# Altium schematic sheet GBA.SchDoc
size A2
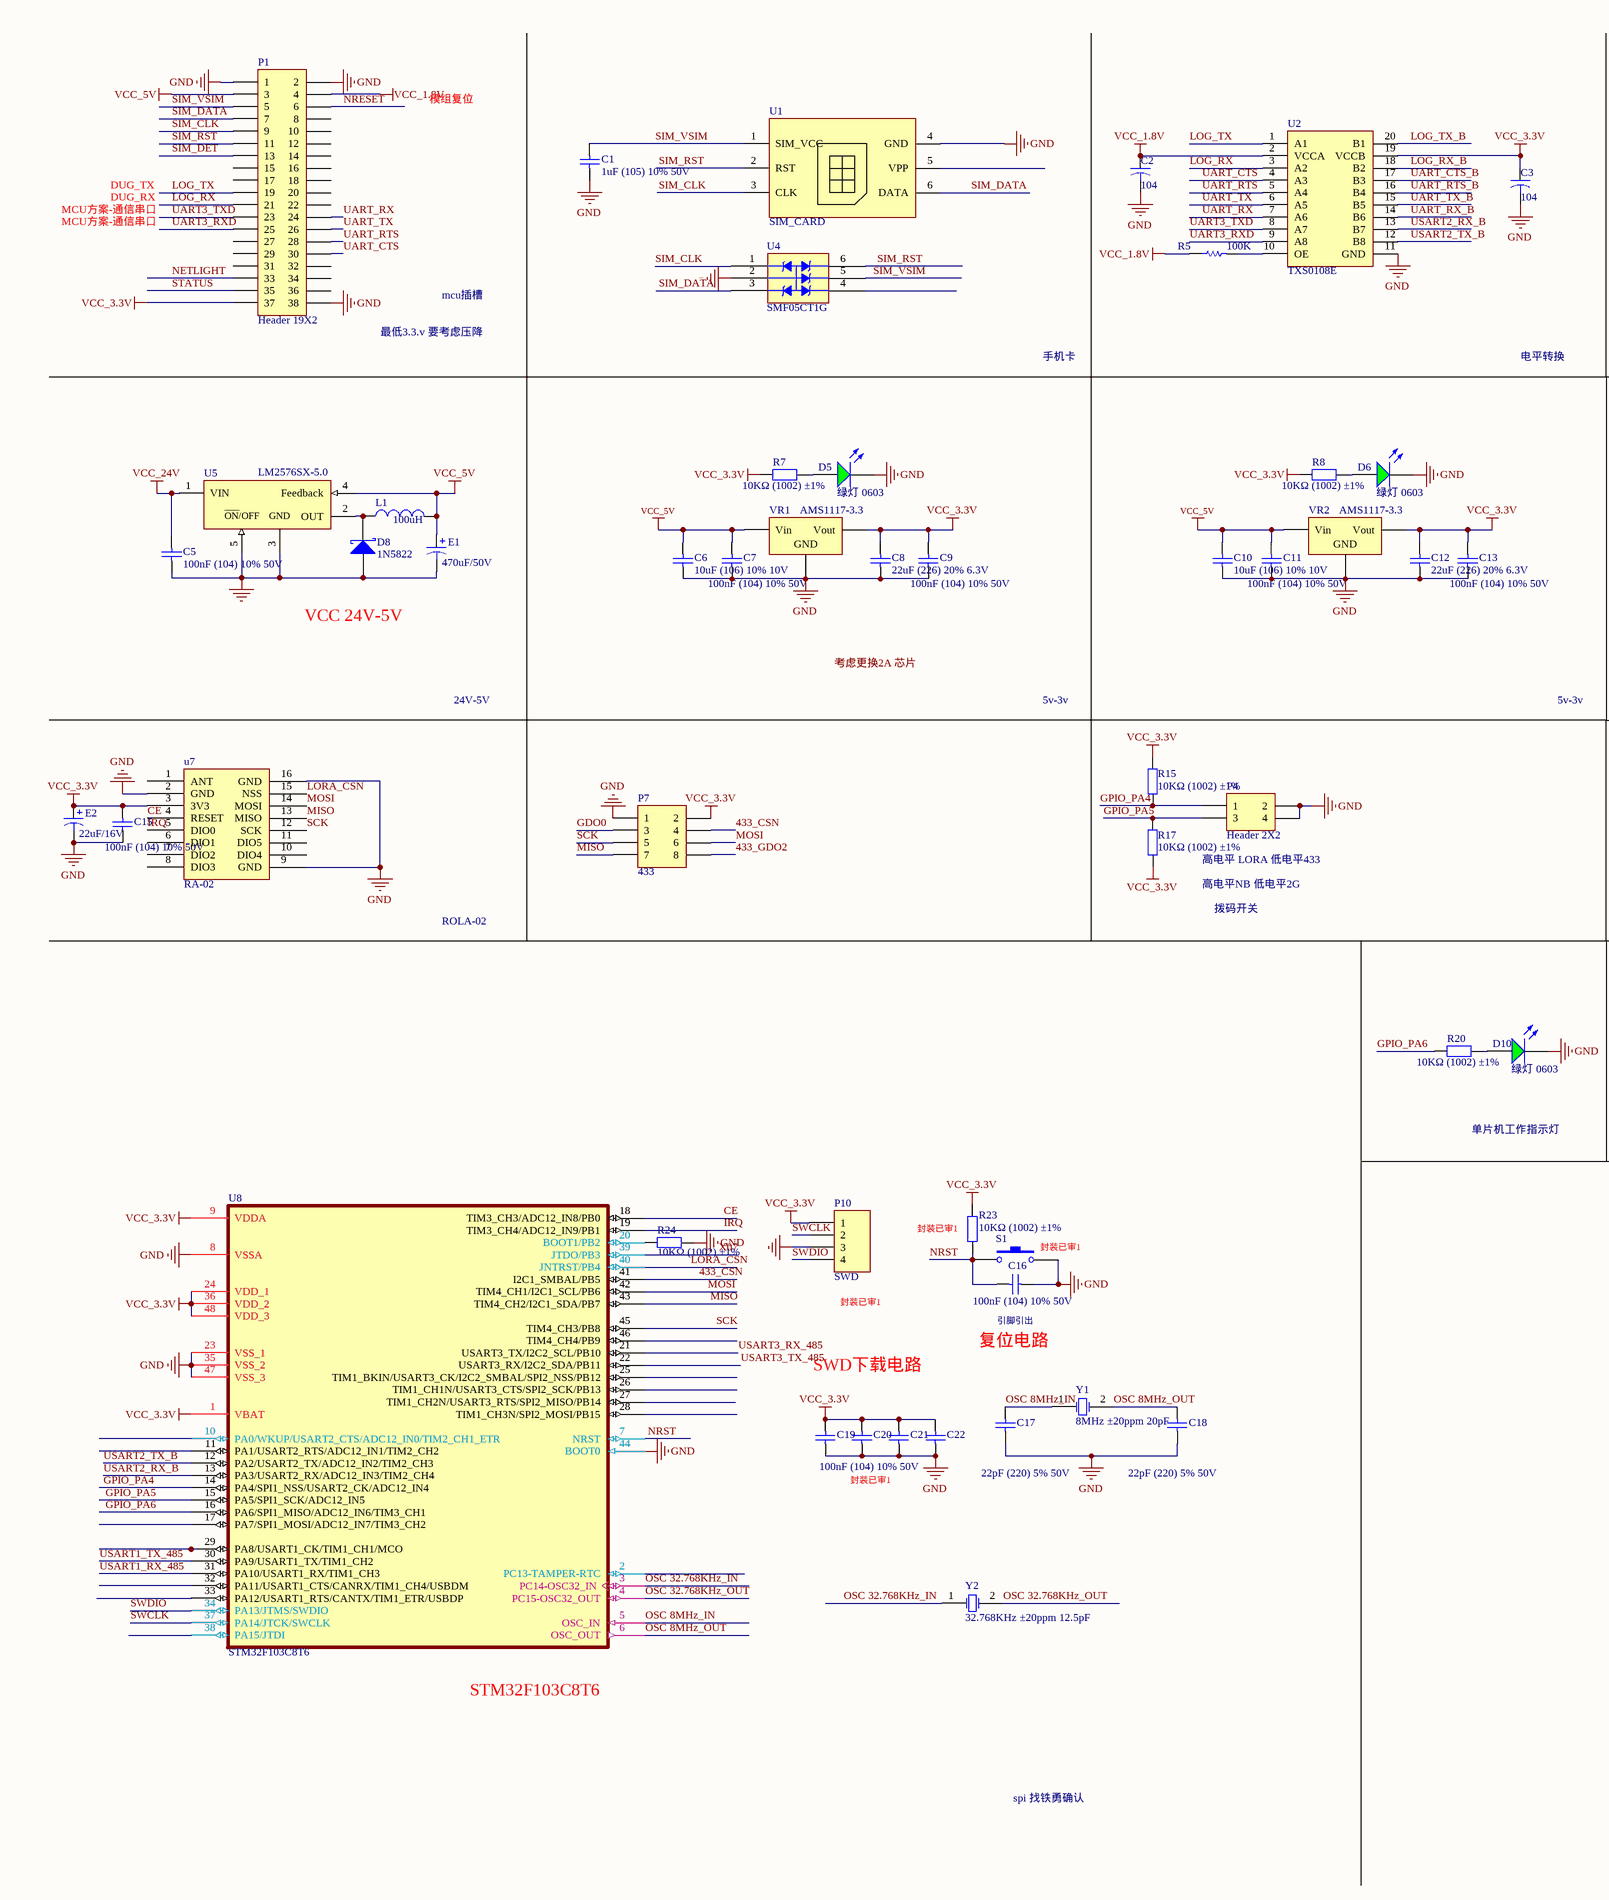
[diagram p0: GBA.SchDoc, left]
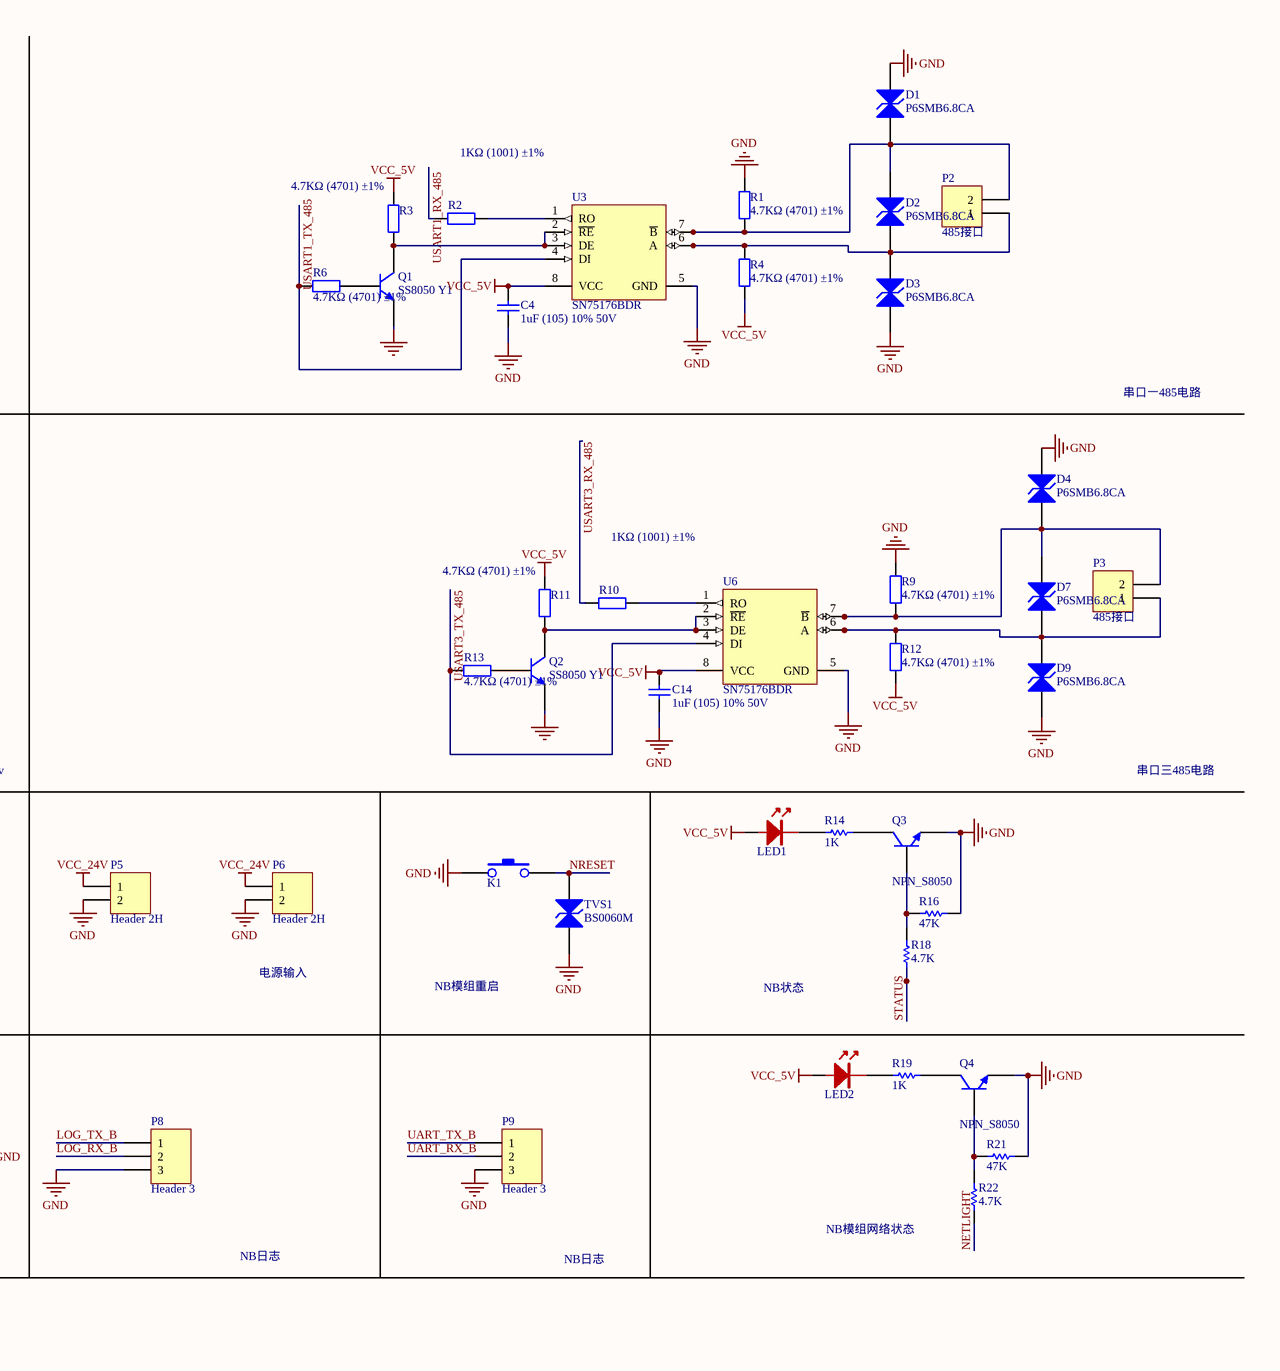
[diagram p1: GBA.SchDoc, right]

## Parts
C1  1uF (105) 10% 50V  [0603_C]
C2  104  [0603_s]
C3  104  [0603_s]
C4  1uF (105) 10% 50V  [0603_C]
C5  100nF (104) 10% 50V  [0603_C]
C6  10uF (106) 10% 10V  [0603_C]
C7  100nF (104) 10% 50V  [CAPC_0603_2]
C8  22uF (226) 20% 6.3V  [0603_C]
C9  100nF (104) 10% 50V  [CAPC_0603_2]
C10  10uF (106) 10% 10V  [0603_C]
C11  100nF (104) 10% 50V  [CAPC_0603_2]
C12  22uF (226) 20% 6.3V  [0603_C]
C13  100nF (104) 10% 50V  [CAPC_0603_2]
C14  1uF (105) 10% 50V  [0603_C]
C15  100nF (104) 10% 50V  [CAPC_0603_2]
C16  100nF (104) 10% 50V  [CAPC_0603_2]
C17  22pF (220) 5% 50V  [0603_C]
C18  22pF (220) 5% 50V  [0603_C]
C19  100nF (104) 10% 50V  [CAPC_0603_2]
C20  100nF (104) 10% 50V  [CAPC_0603_2]  (value not drawn)
C21  100nF (104) 10% 50V  [CAPC_0603_2]  (value not drawn)
C22  100nF (104) 10% 50V  [CAPC_0603_2]  (value not drawn)
D1  P6SMB6.8CA  [SMB(DO-214AA)_S1]
D2  P6SMB6.8CA  [SMB(DO-214AA)_S1]
D3  P6SMB6.8CA  [SMB(DO-214AA)_S1]
D4  P6SMB6.8CA  [SMB(DO-214AA)_S1]
D5  绿灯 0603  [0603_LED_S1]
D6  绿灯 0603  [0603_LED_S1]
D7  P6SMB6.8CA  [SMB(DO-214AA)_S1]
D8  1N5822  [DO214_SMA]
D9  P6SMB6.8CA  [SMB(DO-214AA)_S1]
D10  绿灯 0603  [0603_LED_S1]
E1  value 470uF/50V  [CAP_PR_5.0_13]  (hidden comment: Cap Pol1)
E2  value 22uF/16V  [CAP_PR_5.0_13]  (hidden comment: Cap Pol1)
K1  KEY  [KEY_4_s]  (value not drawn)
L1  100uH  [Inductor_CDRH127R]
LED1  LED_0805  [0805_LED]  (value not drawn)
LED2  LED_0805  [0805_LED]  (value not drawn)
P1  Header 19X2  [GOKIT4_DIP]
P2  485接口  [2EDGK-2P]
P3  485接口  [2EDGK-2P]
P4  Header 2X2  [HDR2X2]
P5  Header 2H  [HDR1X2H]
P6  Header 2H  [HDR1X2H]
P7  433  [HDR2X4]
P8  Header 3  [HDR1X3]
P9  Header 3  [HDR1X3]
P10  Header 2.54X4  [Header 2.54X4]  (value not drawn)
Q1  SS8050 Y1  [SOT-23(SOT-23-3)]
Q2  SS8050 Y1  [SOT-23(SOT-23-3)]
Q3  NPN_S8050  [SOT-23]
Q4  NPN_S8050  [SOT-23]
R1  4.7KΩ (4701) ±1%  [0603_R]
R2  1KΩ (1001) ±1%  [0603_R]
R3  4.7KΩ (4701) ±1%  [0603_R]
R4  4.7KΩ (4701) ±1%  [0603_R]
R5  100K  [0603_s]
R6  4.7KΩ (4701) ±1%  [0603_R]
R7  10KΩ (1002) ±1%  [RESC_0603_2]
R8  10KΩ (1002) ±1%  [RESC_0603_2]
R9  4.7KΩ (4701) ±1%  [0603_R]
R10  1KΩ (1001) ±1%  [0603_R]
R11  4.7KΩ (4701) ±1%  [0603_R]
R12  4.7KΩ (4701) ±1%  [0603_R]
R13  4.7KΩ (4701) ±1%  [0603_R]
R14  1K  [0603_s]
R15  10KΩ (1002) ±1%  [RESC_0603_2]
R16  47K  [0603_s]
R17  10KΩ (1002) ±1%  [RESC_0603_2]
R18  4.7K  [0603_s]
R19  1K  [0603_s]
R20  10KΩ (1002) ±1%  [RESC_0603_2]
R21  47K  [0603_s]
R22  4.7K  [0603_s]
R23  10KΩ (1002) ±1%  [RESC_0603_2]
R24  10KΩ (1002) ±1%  [RESC_0603_2]
S1  SW-PB  [SW_PB_3X6]  (value not drawn)
TVS1  BS0060M  [0603_s]
U1  SIM_CARD  [SIM_MICRO_6P_F]
U2  TXS0108E  [TXS0108E]
U3  SN75176BDR  [SOIC-8_150mil]
U4  SMF05CT1G  [SC-70-6(SOT-363)]
U5  LM2576SX-5.0  [TO-263-5]
U6  SN75176BDR  [SOIC-8_150mil]
u7  RA-02
U8  STM32F103C8T6  [LQFP-48_7x7x05P]
VR1  AMS1117-3.3  [SOT-223]
VR2  AMS1117-3.3  [SOT-223]
Y1  8MHz ±20ppm 20pF  [SMD-5032_2P]
Y2  32.768KHz ±20ppm 12.5pF  [SMD-3215_2P FC - 135]

## Nets
GND: C1.1 C2.2 C3.2 C4.1 C5.1 C6.1 C7.1 C8.1 C9.1 C10.1 C11.1 C12.1 C13.1 C14.1 C15.1 C16.1 C17.1 C18.1 C19.1 C20.1 C21.1 C22.1 D1.2(K) D3.1(A) D4.2(K) D5.K D6.K D8.1(A) D9.1(A) D10.K E1.2 E2.2 K1.1 P1.1 P1.2 P1.38 P4.2 P4.4 P5.2 P6.2 P7.1 P8.3 P9.3 P10.3 Q1.2(E) Q2.2(E) Q3.2(E) Q4.2(E) R1.2 R9.2 R16.2 R21.2 R24.2 S1.2 TVS1.1(A) U1.4(GND) U2.11(GND) U3.5(GND) U4.2 U5.3(DGND) U5.5(ON/OFF) U6.5(GND) u7.2(GND) u7.9(GND) u7.16(GND) U8.8(VSSA) U8.23(VSS_1) U8.35(VSS_2) U8.44(BOOT0) U8.47(VSS_3) VR1.1(GND) VR2.1(GND)
VCC_1.8V: C2.1 P1.4 R5.1 U2.2(VCCA)
VCC_3.3V: C3.1 C8.2 C9.2 C12.2 C13.2 C15.2 C19.2 C20.2 C21.2 C22.2 E2.1 P1.37 P7.2 P10.1 R7.1 R8.1 R15.2 R17.1 R23.2 U2.19(VCCB) u7.3(3V3) U8.1(VBAT) U8.9(VDDA) U8.24(VDD_1) U8.36(VDD_2) U8.48(VDD_3) VR1.2(Vout) VR2.2(Vout)
VCC_5V: C4.2 C6.2 C7.2 C10.2 C11.2 C14.2 E1.1 L1.2 LED1.1 LED2.1 P1.3 R3.2 R4.1 R11.2 R12.1 U3.8(VCC) U5.4(Feedback) U6.8(VCC) VR1.3(Vin) VR2.3(Vin)
VCC_24V: C5.2 P5.1 P6.1 U5.1(VIN)
433_CSN: P7.4 U8.41(I2C1_SMBAL/PB5)
433_GDO2: P7.8
CE: u7.4(RESET) U8.18(TIM3_CH3/ADC12_IN8/PB0)
GDO0: P7.3
GPIO_PA4: P4.1 R15.1 U8.14(PA4/SPI1_NSS/USART2_CK/ADC12_IN4)
GPIO_PA5: P4.3 R17.2 U8.15(PA5/SPI1_SCK/ADC12_IN5)
GPIO_PA6: R20.1 U8.16(PA6/SPI1_MISO/ADC12_IN6/TIM3_CH1)
IRQ: u7.5(DIO0) U8.19(TIM3_CH4/ADC12_IN9/PB1)
LOG_RX: P1.21 U2.3(A2)
LOG_RX_B: P8.2 U2.18(B2)
LOG_TX: P1.19 U2.1(A1)
LOG_TX_B: P8.1 U2.20(B1)
LORA_CSN: u7.15(NSS) U8.40(JNTRST/PB4)
MISO: P7.7 u7.13(MISO) U8.43(TIM4_CH2/I2C1_SDA/PB7)
MOSI: P7.6 u7.14(MOSI) U8.42(TIM4_CH1/I2C1_SCL/PB6)
NETLIGHT: P1.33 R22.2
NRESET: K1.2 P1.6 TVS1.2(K)
NRST: C16.2 R23.1 S1.1 U8.7(NRST)
OSC 8MHz_IN: C17.2 U8.5(OSC_IN) Y1.1(OSC1)
OSC 8MHz_OUT: C18.2 U8.6(OSC_OUT) Y1.2(OSC2)
OSC 32.768KHz_IN: U8.3(PC14-OSC32_IN) Y2.1(OSC1)
OSC 32.768KHz_OUT: U8.4(PC15-OSC32_OUT) Y2.2(OSC2)
SCK: P7.5 u7.12(SCK) U8.45(TIM4_CH3/PB8)
SIM_CLK: P1.9 U1.3(CLK) U4.1
SIM_DATA: P1.7 U1.6(DATA) U4.3
SIM_DET: P1.13
SIM_RST: P1.11 U1.2(RST) U4.6
SIM_VSIM: C1.2 P1.5 U1.1(SIM_VCC) U4.5
STATUS: P1.35 R18.2
SWCLK: P10.2 U8.37(PA14/JTCK/SWCLK)
SWDIO: P10.4 U8.34(PA13/JTMS/SWDIO)
UART3_RXD: P1.25 U2.9(A8)
UART3_TXD: P1.23 U2.8(A7)
UART_CTS: P1.30 U2.4(A3)
UART_CTS_B: U2.17(B3)
UART_RTS: P1.28 U2.5(A4)
UART_RTS_B: U2.16(B4)
UART_RX: P1.24 U2.7(A6)
UART_RX_B: P9.2 U2.14(B6)
UART_TX: P1.26 U2.6(A5)
UART_TX_B: P9.1 U2.15(B5)
USART1_RX_485: R2.1 U8.31(PA10/USART1_RX/TIM1_CH3)
USART1_TX_485: U8.30(PA9/USART1_TX/TIM1_CH2)
USART2_RX_B: U2.13(B7) U8.13(PA3/USART2_RX/ADC12_IN3/TIM2_CH4)
USART2_TX_B: U2.12(B8) U8.12(PA2/USART2_TX/ADC12_IN2/TIM2_CH3)
USART3_RX_485: R10.1 U8.21(USART3_TX/I2C2_SCL/PB10)
USART3_TX_485: R13.1 U6.4(DI) U8.22(USART3_RX/I2C2_SDA/PB11)
X07: U8.39(JTDO/PB3)
NetD1_1: D1.1(A) D2.2(K) P2.2 R1.1 U3.7(~{B})
NetD2_1: D2.1(A) D3.2(K) P2.1 R4.2 U3.6(A)
NetD4_1: D4.1(A) D7.2(K) P3.2 R9.1 U6.7(~{B})
NetD5_A: D5.A R7.2
NetD6_A: D6.A R8.2
NetD7_1: D7.1(A) D9.2(K) P3.1 R12.2 U6.6(A)
NetD8_2: D8.2(K) L1.1 U5.2(OUT)
NetD10_A: D10.A R20.2
NetLED1_2: LED1.2 R14.2
NetLED2_2: LED2.2 R19.2
NetQ1_1: Q1.1(B) R6.2
NetQ1_3: Q1.3(C) R3.1 U3.2(~{RE}) U3.3(DE)
NetQ2_1: Q2.1(B) R13.2
NetQ2_3: Q2.3(C) R11.1 U6.2(~{RE}) U6.3(DE)
NetQ3_1: Q3.1(B) R16.1 R18.1
NetQ3_3: Q3.3(C) R14.1
NetQ4_1: Q4.1(B) R21.1 R22.1
NetQ4_3: Q4.3(C) R19.1
NetR2_2: R2.2 U3.1(RO)
NetR5_2: R5.2 U2.10(OE)
NetR6_1: R6.1 U3.4(DI)
NetR10_2: R10.2 U6.1(RO)
NetR24_1: R24.1 U8.20(BOOT1/PB2)

Not connected (* = marked no-connect by the designer): P1 8 10 12 14 15 16 17 18 20 22 27 29 31 32 34 36; U1 5(VPP); U4 4; u7 1(ANT) 6(DIO1) 7(DIO2) 8(DIO3) 10(DIO4) 11(DIO5); U8 2(PC13-TAMPER-RTC) 10(PA0/WKUP/USART2_CTS/ADC12_IN0/TIM2_CH1_ETR) 11(PA1/USART2_RTS/ADC12_IN1/TIM2_CH2) 17(PA7/SPI1_MOSI/ADC12_IN7/TIM3_CH2) 25(TIM1_BKIN/USART3_CK/I2C2_SMBAL/SPI2_NSS/PB12) 26(TIM1_CH1N/USART3_CTS/SPI2_SCK/PB13) 27(TIM1_CH2N/USART3_RTS/SPI2_MISO/PB14) 28(TIM1_CH3N/SPI2_MOSI/PB15) 29(PA8/USART1_CK/TIM1_CH1/MCO) 32(PA11/USART1_CTS/CANRX/TIM1_CH4/USBDM) 33(PA12/USART1_RTS/CANTX/TIM1_ETR/USBDP) 38(PA15/JTDI) 46(TIM4_CH4/PB9)

## Notes on the sheet
- 模组复位
- MCU方案-通信串口
- DUG_TX
- DUG_RX
- 最低3.3.v 要考虑压降
- mcu插槽
- 手机卡
- 电平转换
- 串口一485电路
- VCC 24V-5V
- 24V-5V
- 5v-3v
- 串口三485电路
- 高电平 LORA 低电平433
- 高电平NB 低电平2G
- 电源输入
- NB模组重启
- NB状态
- ROLA-02
- 拨码开关
- 单片机工作指示灯
- NB日志
- NB模组网络状态
- (near R23) 封装已审1
- (near S1) 封装已审1
- (near P10) 封装已审1
- (near C16) 引脚引出
- SWD下载电路
- 复位电路
- 封装已审1
- (near U8) STM32F103C8T6
- spi 找铁勇确认
- Labels drawn without touching a wire or pin: USART1_TX_485, 考虑更换2A 芯片
- (in symbol LM2576SX-5.0_[C34465]) ___; GND

## Library data of the parts
C1 C4 C14 = 0603 1uF (105) 10% 50V: 贴片电容; ComponentLink1Description: 供应商链接; ComponentLink1URL: http://www.szlcsc.com/product/details_16531.html; Package: 0603; Supplier: LC; SuppliersPartNumber: C15849
C2 C3 = Cap2: 物料类型: 电容; 厂家: 国产
C5 C7 C9 C11 C13 C15 C16 C19-C22 = 0603 100nF (104) 10% 50V: 贴片电容; ComponentLink1Description: 供应商链接; ComponentLink1URL: http://www.szlcsc.com/product/details_15331.html; Package: 0603; Supplier: LC; SuppliersPartNumber: C14663
C6 C10 = 0603 10uF (106) 10% 10V: 贴片电容; ComponentLink1Description: 供应商链接; ComponentLink1URL: http://www.szlcsc.com/product/details_20411.html; Package: 0603; Supplier: LC; SuppliersPartNumber: C19702
C8 C12 = 0603 22uF (226) 20% 6.3V: 贴片电容; ComponentLink1Description: 供应商链接; ComponentLink1URL: http://www.szlcsc.com/product/details_60514.html; Package: 0603; Supplier: LC; SuppliersPartNumber: C59461
C17 C18 = 0603 22pF (220) 5% 50V: 贴片电容; ComponentLink1Description: 供应商链接; ComponentLink1URL: http://www.szlcsc.com/product/details_2005.html; Package: 0603; Supplier: LC; SuppliersPartNumber: C1653
D1-D4 D7 D9 = SMB/DO-214AA P6SMB6.8CA: TVS; ComponentLink1Description: 供应商链接; ComponentLink1URL: http://www.szlcsc.com/product/details_79530.html; Package: SMB/DO-214AA; Supplier: LC; SuppliersPartNumber: C78395
D5 D6 D10 = 0603 绿灯: 发光二极管; ComponentLink1Description: 供应商链接; ComponentLink1URL: http://www.szlcsc.com/product/details_73152.html; Package: 0603; Supplier: LC; SuppliersPartNumber: C72043
D8 = SMA(DO-214AC) 1N5822: 整流二极管; ComponentLink1Description: 供应商链接; ComponentLink1URL: http://www.szlcsc.com/product/details_2841.html; Package: SMA(DO-214AC)
E1 E2 = Cap Pol1: Polarized Capacitor (Radial); Published: 8-Jun-2000; LatestRevisionDate: 17-Jul-2002; LatestRevisionNote: Re-released for DXP Platform.; PackageReference: RB7.6-15; Publisher: Altium Limited
K1 = KEY2_1
L1 = Inductor: Code_IEC: 1005; Published: 8-Jun-2000; LatestRevisionDate: 29-May-2009; LatestRevisionNote: IPC-7351 Footprint Added.; PackageReference: 0402-A; Publisher: Altium Limited; PackageDescription: Chip Inductor; Code_JEITA: 0402; Value: 100uH
P1 = Header 19X2: Header, 19-Pin, Dual row; LatestRevisionDate: 17-Jul-2002; LatestRevisionNote: Re-released for DXP Platform.; Publisher: Altium Limited
P2 P3 = Header 2: Header, 2-Pin; LatestRevisionDate: 17-Jul-2002; LatestRevisionNote: Re-released for DXP Platform.; Publisher: Altium Limited
P4 = Header 2X2: Header, 2-Pin, Dual row; LatestRevisionDate: 17-Jul-2002; LatestRevisionNote: Re-released for DXP Platform.; Publisher: Altium Limited
P5 P6 = Header 2H: Header, 2-Pin, Right Angle; LatestRevisionDate: 17-Jul-2002; LatestRevisionNote: Re-released for DXP Platform.; Publisher: Altium Limited
P7 = Header 4X2: Header, 4-Pin, Dual row; LatestRevisionDate: 17-Jul-2002; LatestRevisionNote: Re-released for DXP Platform.; Publisher: Altium Limited
P8 P9 = Header 3: Header, 3-Pin; LatestRevisionDate: 17-Jul-2002; LatestRevisionNote: Re-released for DXP Platform.; Publisher: Altium Limited
P10 = Header 4: Header, 4-Pin; LatestRevisionDate: 17-Jul-2002; LatestRevisionNote: Re-released for DXP Platform.; Publisher: Altium Limited; SWD: SWD
Q1 Q2 = SOT-23 SS8050 Y1: 三极管; ComponentLink1Description: 供应商链接; ComponentLink1URL: http://www.szlcsc.com/product/details_2507.html; Package: SOT-23; Supplier: LC; SuppliersPartNumber: C2150
Q3 Q4 = NPN_SOT23
R1 R3 R4 R6 R9 R11-R13 = 0603 4.7KΩ (4701) 1%: 贴片电阻; ComponentLink1Description: 供应商链接; ComponentLink1URL: http://www.szlcsc.com/product/details_23889.html; Package: 0603; Supplier: LC; SuppliersPartNumber: C23162
R2 R10 = 0603 1KΩ (1001) 1%: 贴片电阻; ComponentLink1Description: 供应商链接; ComponentLink1URL: http://www.szlcsc.com/product/details_21904.html; Package: 0603; Supplier: LC; SuppliersPartNumber: C21190
R5 R14 R16 R18 R19 R21 R22 = Res1: Resistor; 物料名称: 电阻; 供应商: 三星（Samsung）
R7 R8 R15 R17 R20 R23 R24 = 0603 10KΩ (1002) 1%: 贴片电阻; ComponentLink1Description: 供应商链接; ComponentLink1URL: http://www.szlcsc.com/product/details_26547.html; Package: 0603; Supplier: LC; SuppliersPartNumber: C25804
S1 = SW-PB_1: 微动开关; Published: 24-Mar-1999; LatestRevisionDate: 17-Jul-2002; LatestRevisionNote: Re-released for DXP Platform.; PackageReference: SPST-2; Publisher: Altium Limited
U3 U6 = SN75176BDR_[C7063]: RS-485/RS-422; ComponentLink1Description: 供应商链接; ComponentLink1URL: http://www.szlcsc.com/product/details_7535.html; Package: SOIC-8_150mil; Supplier: LC; SuppliersPartNumber: C7063
U4 = SMF05CT1G_[C15879]: TVS; ComponentLink1Description: 供应商链接; ComponentLink1URL: http://www.szlcsc.com/product/details_16561.html; Package: SC-70-6(SOT-363); Supplier: LC; SuppliersPartNumber: C15879
U5 = LM2576SX-5.0_[C34465]: DC-DC芯片; ComponentLink1Description: 供应商链接; ComponentLink1URL: http://www.szlcsc.com/product/details_35434.html; Package: TO-263-5; Supplier: LC; SuppliersPartNumber: C34465
u7 = RA
U8 = STM32F103C8T6: ARM; ComponentLink1Description: 供应商链接; ComponentLink1URL: http://www.szlcsc.com/product/details_9243.html; Package: LQFP-48_7x7x05P; Supplier: LC; SuppliersPartNumber: C8734
VR1 VR2 = SOT-223 AMS1117-3.3: 低压差线性稳压(LDO); ComponentLink1Description: 供应商链接; ComponentLink1URL: http://www.szlcsc.com/product/details_6652.html; Package: SOT-223; Supplier: LC; SuppliersPartNumber: C6186
Y1 = SMD-5032_2P 8MHz 20ppm 20pF: 贴片晶振; ComponentLink1Description: 供应商链接; ComponentLink1URL: http://www.szlcsc.com/product/details_117214.html; Package: SMD-5032_2P; Supplier: LC; SuppliersPartNumber: C115962
Y2 = SMD-3215_2P 32.768KHz 20ppm 12.5pF: 贴片晶振; ComponentLink1Description: 供应商链接; ComponentLink1URL: http://www.szlcsc.com/product/details_33310.html; Package: SMD-3215_2P; Supplier: LC; SuppliersPartNumber: C32346